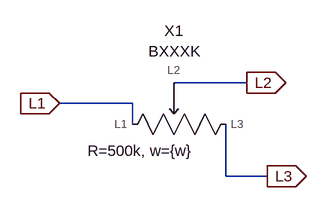
[diagram p0: schematic B500K.asc]
B500K.asc, the LTspice schematic file:
Version 4
SHEET 1 880 680
WIRE 320 160 208 160
WIRE 144 192 32 192
WIRE 144 224 144 192
WIRE 288 304 288 224
WIRE 352 304 288 304
FLAG 32 192 L1
IOPIN 32 192 In
FLAG 320 160 L2
IOPIN 320 160 Out
FLAG 352 304 L3
IOPIN 352 304 Out
SYMBOL Base_BxxxK 208 176 R0
WINDOW 39 -52 89 Center 2
SYMATTR SpiceLine R=500k, w={w}
SYMATTR InstName X1
SYMATTR Description May be used for modeling linear potentiometers. Parameters: R, x. By default, R = 100 ohms and x is undefined. x must be within the range of [0, 1]. At x = 0, there will be no output signal.

The netlist it stands for:
* B500K.asc
XX1 L1 L2 L3 BXXXK R=500k, w={w}  ; pins L1 L2 L3
.backanno
.end